# EasyEDA schematic Wakeup_Transmitter.json
TITLE: MyExoMy Wakeup Transmiter; REV: 1.0; Date: 2021-10-10; Sheet: 1/1; Company: Your Company
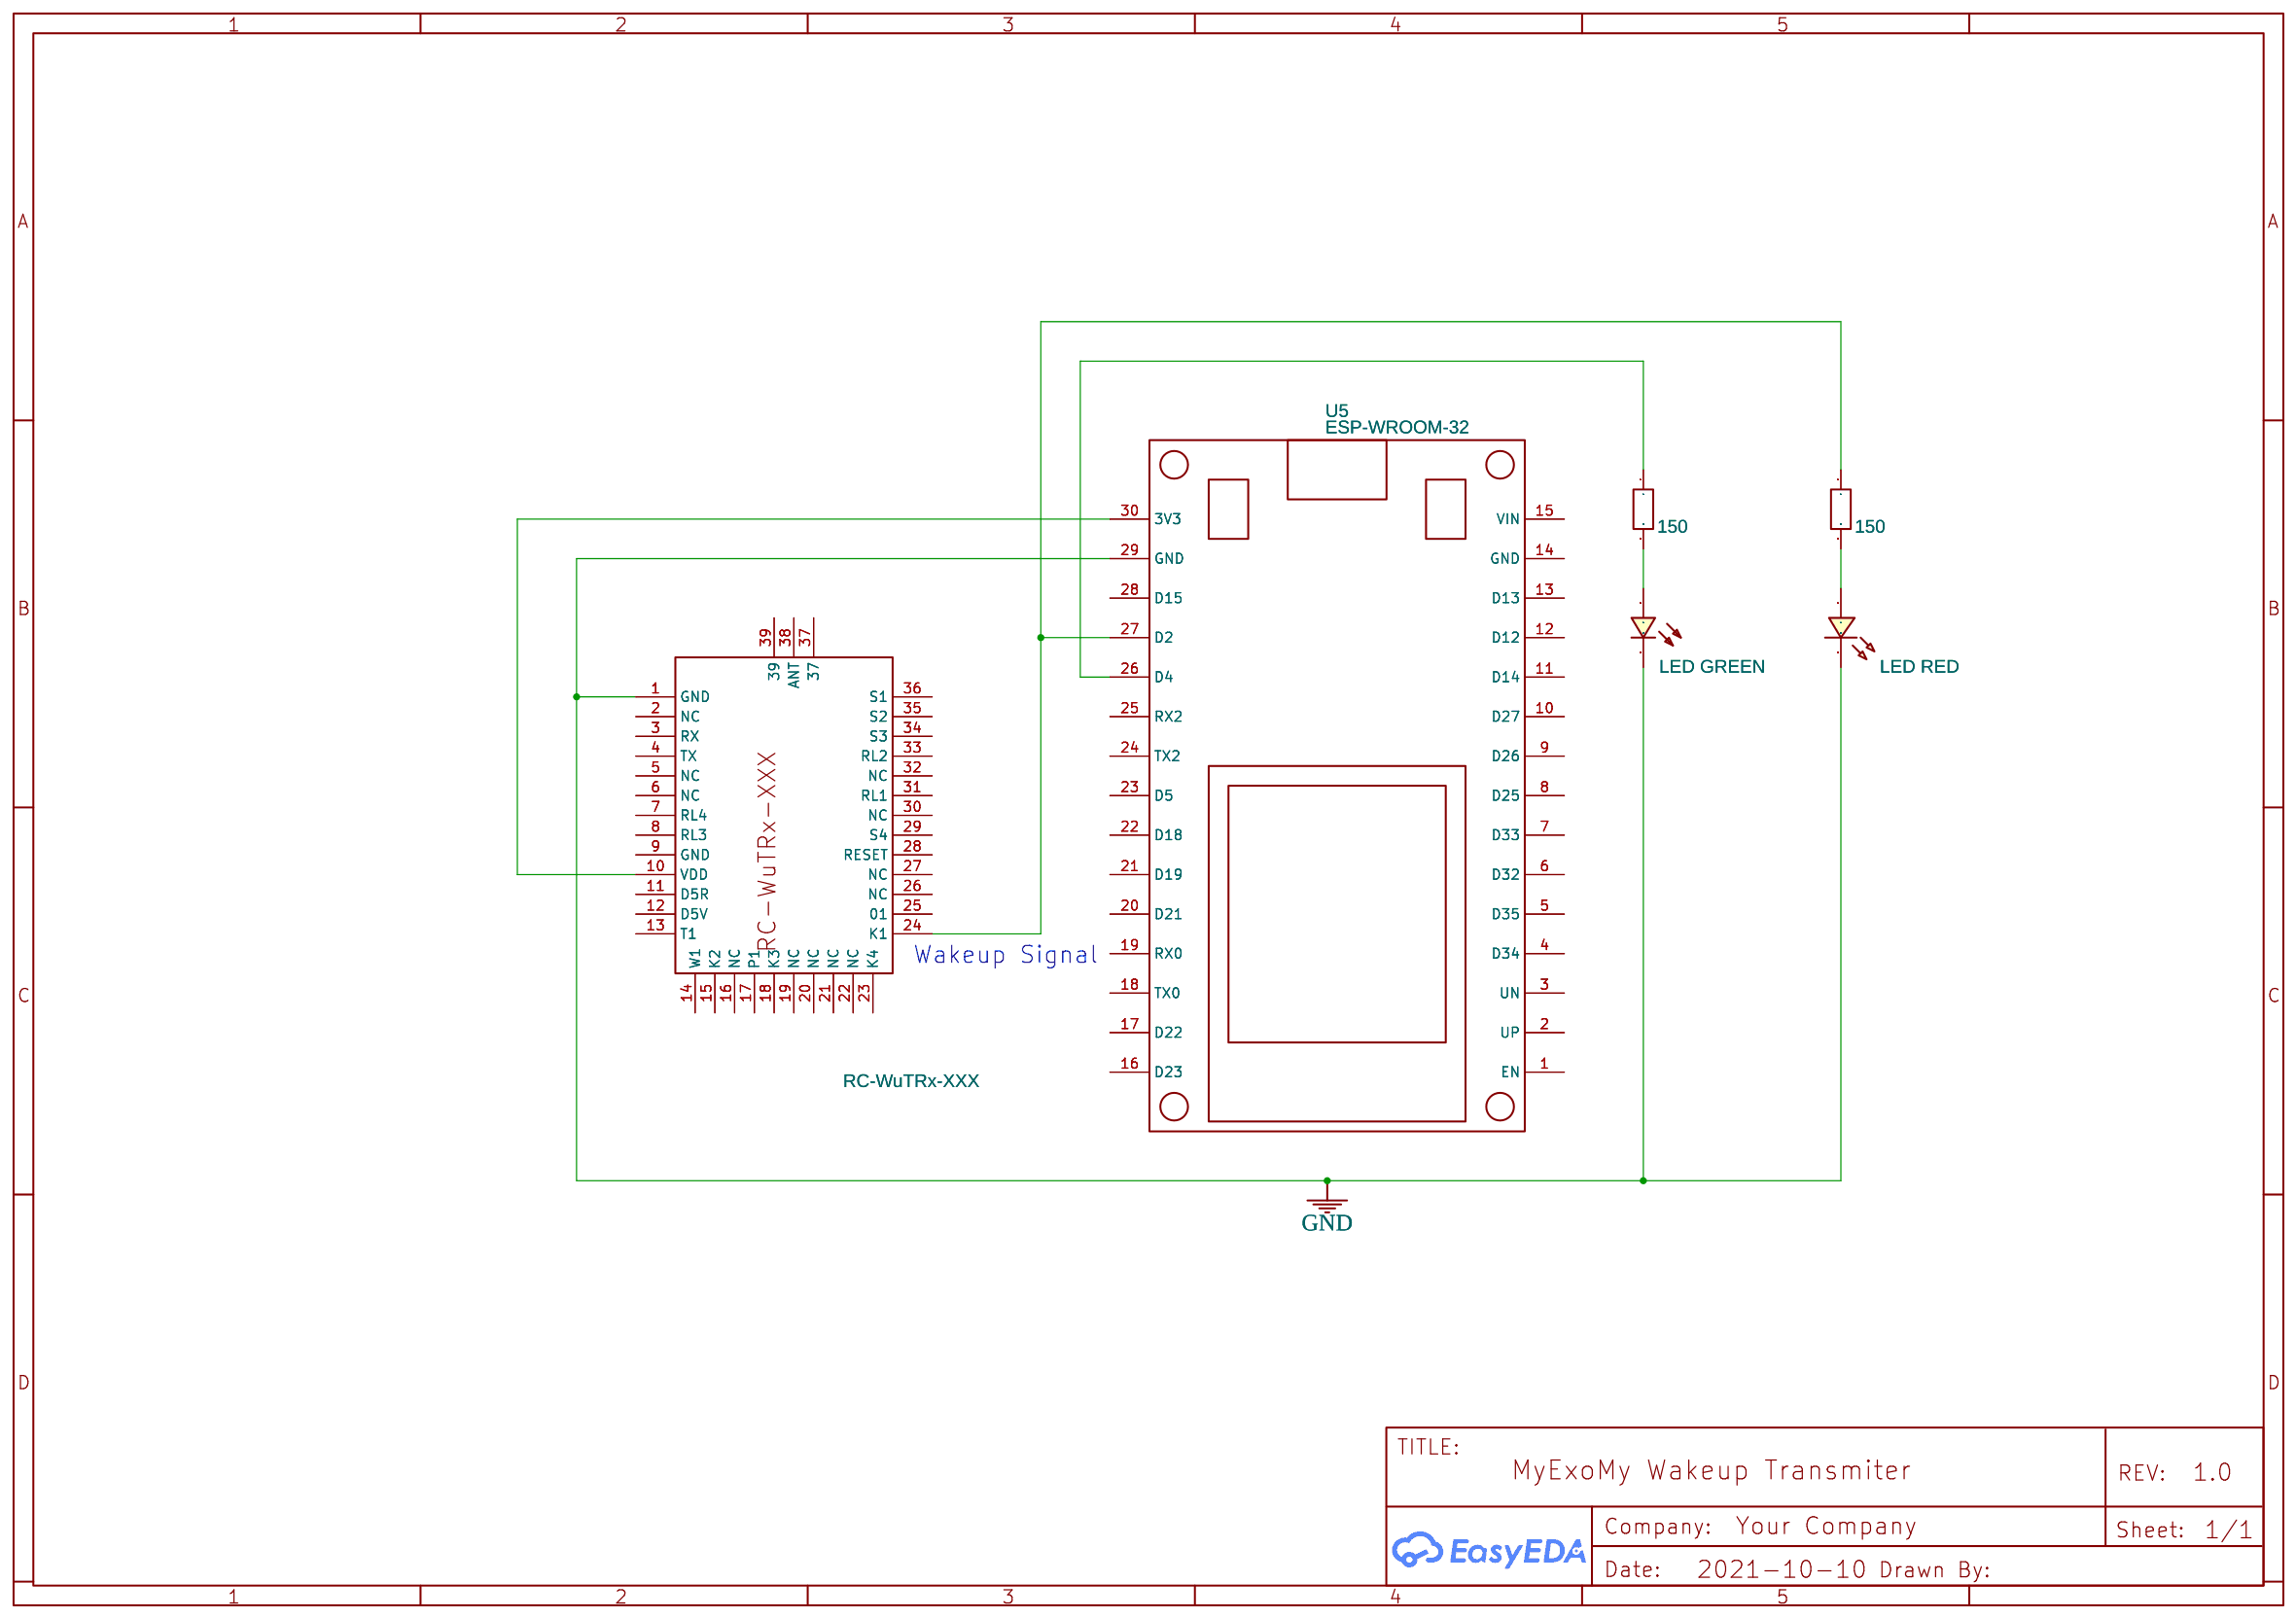
[diagram p0: schematic sheet]

## Parts
1  LED GREEN  [LED-GREEN-D4]
LED1  LED RED  [LED0603_RED]
R15  150  [R0603]
R16  150  [R0603]
U5  ESP-WROOM-32  [ESP32 DEVELOPMENT BOARD ABUOMAR]
U7  RC-WuTRx-XXX  [RC-WUTRX-XXX]

## Library data of the parts
1 = LED GREEN D4
LED1 = LED-0603_R: Manufacturer: EVERLIGHT(台湾亿光); Manufacturer Part: 19-217/R6C-AL1M2VY/3T; Supplier Part: C72044; Supplier: LCSC; Contributor: LCEDA_01
R15 R16 = R_0603_EU: Contributor: LCEDA_Lib
U5 = ESP-WROOM-32: Manufacturer Part: ESP32 Development Board; Contributor: Allen Penner; Manufacturer: HiLetgo
U7 = RC-WuTRx-XXX: Manufacturer: Radio Controlli; Supplier: Radio Controlli; link: https://www.radiocontrolli.com/files/datasheets/RC-WuTRx_ENG.pdf; Contributor: markopl96

## Nets
GND: 1.2 LED1.2 U5.29(GND) U7.1(GND)
Net-(1-1): 1.1 R15.2
Net-(LED1-1): LED1.1 R16.2
Net-(R15-1): R15.1 U5.26(D4)
Net-(R16-1): R16.1 U5.27(D2) U7.24(K1)
Net-(U5-30): U5.30(3V3) U7.10(VDD)

Not connected (* = marked no-connect by the designer): U5 1(EN) 2(UP) 3(UN) 4(D34) 5(D35) 6(D32) 7(D33) 8(D25) 9(D26) 10(D27) 11(D14) 12(D12) 13(D13) 14(GND) 15(VIN) 16(D23) 17(D22) 18(TX0) 19(RX0) 20(D21) 21(D19) 22(D18) 23(D5) 24(TX2) 25(RX2) 28(D15); U7 2(NC) 3(RX) 4(TX) 5(NC) 6(NC) 7(RL4) 8(RL3) 9(GND) 11(D5R) 12(D5V) 13(T1) 14(W1) 15(K2) 16(NC) 17(P1) 18(K3) 19(NC) 20(NC) 21(NC) 22(NC) 23(K4) 25(01) 26(NC) 27(NC) 28(RESET) 29(S4) 30(NC) 31(RL1) 32(NC) 33(RL2) 34(S3) 35(S2) 36(S1) 37 38(ANT) 39

## Notes on the sheet
- Wakeup Signal
